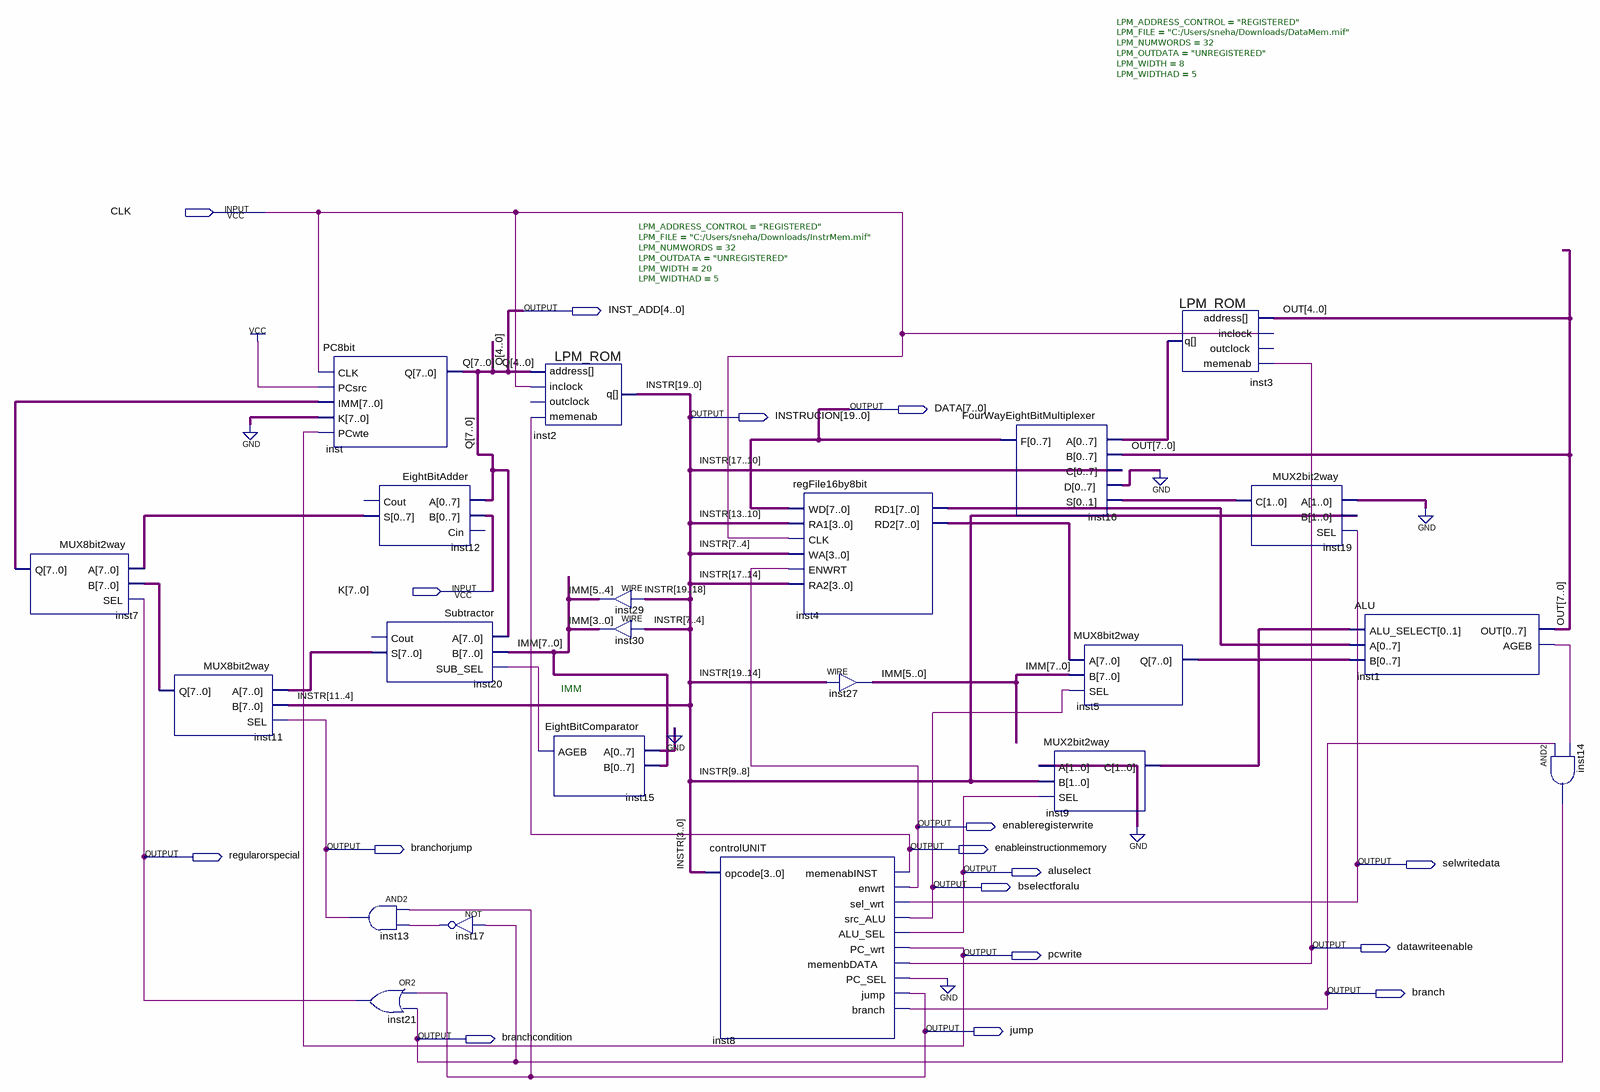
[diagram p0: schematic sheet]
// Quartus schematic DATAPATH01.bdf as structural Verilog: 22 symbols, 17 pins
module DATAPATH01 (
  input  CLK,
  input  [7:0] K,
  output [4:0] INST_ADD,
  output [7:0] DATA,
  output [19:0] INSTRUCION,
  output enableregisterwrite,
  output branchorjump,
  output enableinstructionmemory,
  output regularorspecial,
  output selwritedata,
  output aluselect,
  output bselectforalu,
  output datawriteenable,
  output pcwrite,
  output branch,
  output jump,
  output branchcondition
);

  wire inst1_ageb, inst8_pc_sel, inst15_ageb, inst17_out;
  wire [1:0] inst9_c, inst19_c;
  wire [7:0] IMM, inst3_q, inst4_rd1, inst4_rd2, inst5_q, inst7_q, inst11_q, inst12_s, inst20_s, OUT;
  wire [7:5] Q;

  MUX8bit2way inst7 (.A(inst12_s), .B(inst11_q), .SEL(regularorspecial), .Q(inst7_q));
  MUX8bit2way inst11 (.A(inst20_s), .B(INSTRUCION[11:4]), .SEL(branchorjump), .Q(inst11_q));
  PC8bit inst (.CLK(CLK), .PCsrc(1'b1), .IMM(inst7_q), .K({8{1'b0}}), .PCwte(pcwrite), .Q({Q, INST_ADD}));
  EightBitAdder inst12 (.A({Q, INST_ADD}), .B(K), .S(inst12_s));  // open: Cin, Cout
  and inst13 (branchorjump, jump, inst17_out);
  or inst21 (regularorspecial, jump, branchcondition);
  Subtractor inst20 (.A({Q, INST_ADD}), .B(IMM), .SUB_SEL(inst15_ageb), .S(inst20_s));  // open: Cout
  not inst17 (inst17_out, branchcondition);
  LPM_ROM #(.LPM_ADDRESS_CONTROL("REGISTERED"), .LPM_FILE("C:/Users/sneha/Downloads/InstrMem.mif"), .LPM_NUMWORDS(32), .LPM_OUTDATA("UNREGISTERED"), .LPM_WIDTH(20), .LPM_WIDTHAD(5)) inst2 (
    .address(INST_ADD), .inclock(CLK), .memenab(enableinstructionmemory), .q(INSTRUCION));  // open: outclock
  EightBitComparator inst15 (.A({8{1'b0}}), .B(IMM), .AGEB(inst15_ageb));
  assign IMM[5:4] = INSTRUCION[19:18];  // WIRE inst29
  assign IMM[3:0] = INSTRUCION[7:4];  // WIRE inst30
  controlUNIT inst8 (
    .opcode(INSTRUCION[3:0]), .memenabINST(enableinstructionmemory), .enwrt(enableregisterwrite),
    .sel_wrt(selwritedata), .src_ALU(bselectforalu), .ALU_SEL(aluselect), .PC_wrt(pcwrite),
    .memenbDATA(datawriteenable), .PC_SEL(inst8_pc_sel), .jump(jump), .branch(branch));
  regFile16by8bit inst4 (
    .WD(DATA), .RA1(INSTRUCION[13:10]), .CLK(CLK), .WA(INSTRUCION[7:4]), .ENWRT(enableregisterwrite),
    .RA2(INSTRUCION[17:14]), .RD1(inst4_rd1), .RD2(inst4_rd2));
  assign IMM[5:0] = INSTRUCION[19:14];  // WIRE inst27
  FourWayEightBitMultiplexer inst16 (
    .A(inst3_q), .B(OUT), .C(INSTRUCION[17:10]), .D({8{1'b0}}), .S(inst19_c), .F(DATA));
  MUX8bit2way inst5 (.A(inst4_rd2), .B(IMM), .SEL(bselectforalu), .Q(inst5_q));
  MUX2bit2way inst9 (.A(2'b00), .B(INSTRUCION[9:8]), .SEL(aluselect), .C(inst9_c));
  LPM_ROM #(.LPM_ADDRESS_CONTROL("REGISTERED"), .LPM_FILE("C:/Users/sneha/Downloads/DataMem.mif"), .LPM_NUMWORDS(32), .LPM_OUTDATA("UNREGISTERED"), .LPM_WIDTH(8), .LPM_WIDTHAD(5)) inst3 (
    .address(OUT[4:0]), .inclock(CLK), .memenab(datawriteenable), .q(inst3_q));  // open: outclock
  MUX2bit2way inst19 (.A(2'b00), .B(INSTRUCION[9:8]), .SEL(selwritedata), .C(inst19_c));
  ALU inst1 (.ALU_SELECT(inst9_c), .A(inst4_rd1), .B(inst5_q), .OUT(OUT), .AGEB(inst1_ageb));
  and inst14 (branchcondition, branch, inst1_ageb);
  // also tied to GND on the sheet: inst8_pc_sel

  // Other names for the same wires on the sheet: Q[4:0] = INST_ADD; INSTR[19:0] = INSTRUCION

  // Notes on the sheet:
  //   IMM
endmodule
